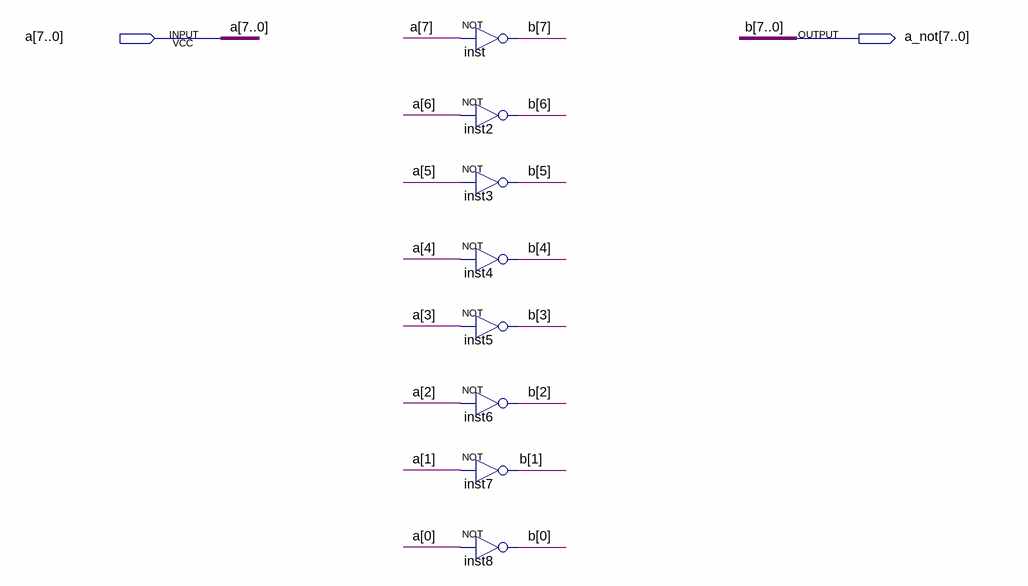
[diagram p0: schematic sheet]
// Quartus schematic not8.bdf as structural Verilog: 8 symbols, 2 pins
module not8 (
  input  [7:0] a,
  output [7:0] a_not
);

  not inst (a_not[7], a[7]);
  not inst2 (a_not[6], a[6]);
  not inst3 (a_not[5], a[5]);
  not inst4 (a_not[4], a[4]);
  not inst5 (a_not[3], a[3]);
  not inst6 (a_not[2], a[2]);
  not inst7 (a_not[1], a[1]);
  not inst8 (a_not[0], a[0]);

  // Other names for the same wires on the sheet: b[7:0] = a_not
endmodule
